# Altium schematic sheet BotInd.SchDoc: BotqueueIndicator
size A; DrawnBy: Mr. Thach; Revision: Rev 1.0
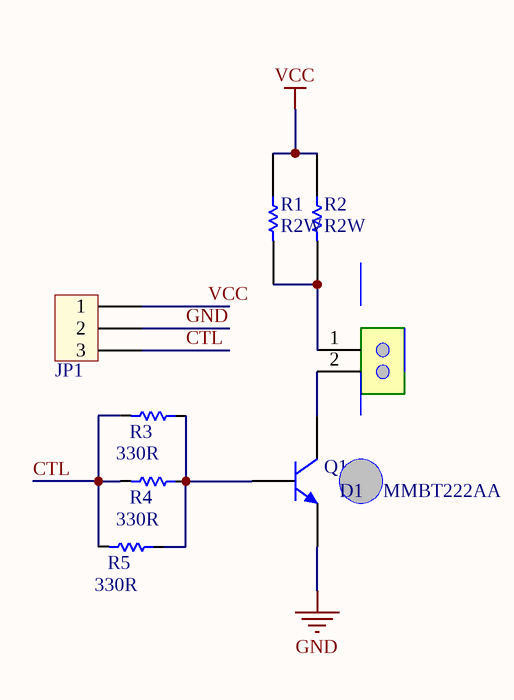
[diagram p0: BotInd.SchDoc]

## Parts
D1  DOMINO  [Domino2_350]  (value not drawn)
JP1  HEAD3  [HEAD3]  (value not drawn)
Q1  MMBT222AA  [SOT23-3]
R1  R2W  [R 2W]
R2  R2W  [R 2W]
R3  0805_R  [0805_R]  (value not drawn)
R4  0805_R  [0805_R]  (value not drawn)
R5  0805_R  [0805_R]  (value not drawn)

## Nets
GND: JP1.2 Q1.2(E)
VCC: JP1.1 R1.1 R2.1
CTL: JP1.3 R3.2 R4.2 R5.2
NetD1_1: D1.1 R1.2 R2.2
NetD1_2: D1.2 Q1.3(C)
NetQ1_1: Q1.1(B) R3.1 R4.1 R5.1

## Notes on the sheet
- (in symbol 0805_R) 330R

## Library data of the parts
D1 = Domino2_small
JP1 = HEAD3: Connector 3; Value: Connector 3
Q1 = MMBT222AA: NPN General Purpose Amplifier; Published: 8-Jun-2000; LatestRevisionDate: 15-Jan-2003; LatestRevisionNote: PCB Footprint 'BCY-W3/D4.7' replaced; DatasheetVersion: 1997; PackageVersion: Sep-1998; PackageReference: TO-92A; Publisher: Altium Limited; PackageDescription: TO, Flat Index; 3 In-Line, Axial Leads; Body Dia. 4.5mm; Leads 0.51 x 0.48 mm (max); ComponentLink1Description: Manufacturer Link; ComponentLink1URL: http://www.fairchildsemi.com/; ComponentLink2Description: Datasheet; ComponentLink2URL: http://www.fairchildsemi.com/ds/2N%2F2N3904.pdf
R3-R5 = 0805_R: 0805 SMD resistor